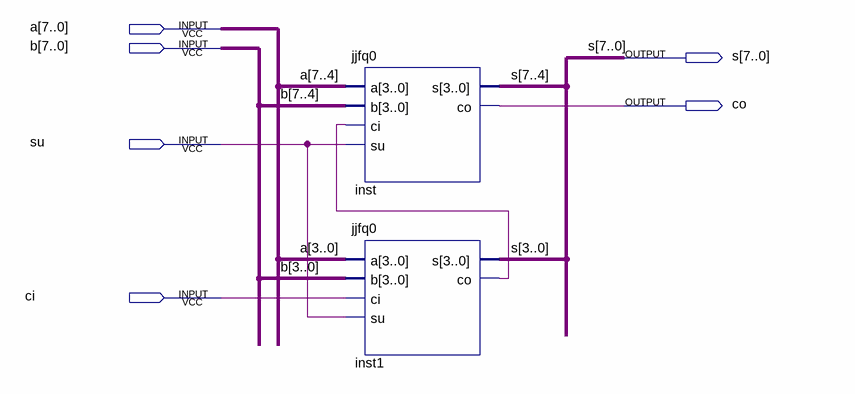
[diagram p0: schematic sheet]
// Quartus schematic jjfq.bdf as structural Verilog: 2 symbols, 6 pins
module jjfq (
  input  [7:0] a,
  input  [7:0] b,
  input  su,
  input  ci,
  output [7:0] s,
  output co
);

  wire inst1_co;

  jjfq0 inst (.a(a[7:4]), .b(b[7:4]), .ci(inst1_co), .su(su), .s(s[7:4]), .co(co));
  jjfq0 inst1 (.a(a[3:0]), .b(b[3:0]), .ci(ci), .su(su), .s(s[3:0]), .co(inst1_co));
endmodule
